# Altium schematic sheet Temperature and Altitude.SchDoc
size A4
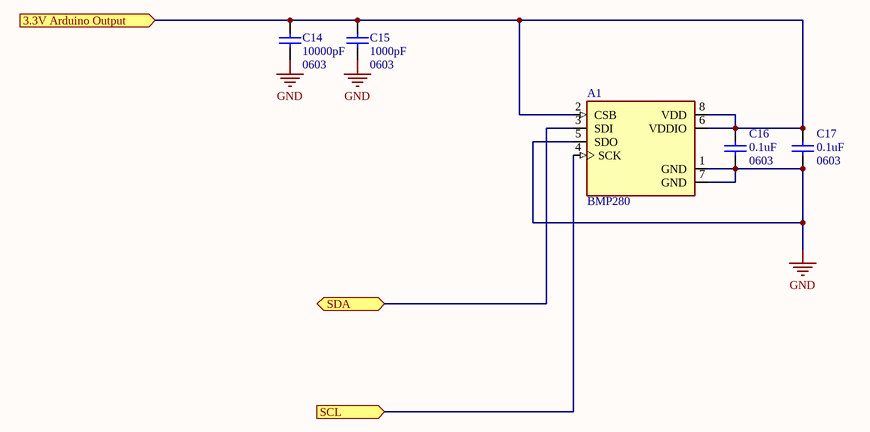
[diagram p0: Temperature and Altitude.SchDoc]

## Parts
A1  BMP280  [8-PIN-METAL-LID-LGA]
C14  10000pF  value 0603  [SMD-0603C]
C15  1000pF  value 0603  [SMD-0603C]
C16  0603  value 0.1uF  [SMD-0603C]
C17  0603  value 0.1uF  [SMD-0603C]

## Ports
3.3V Arduino Output (in), SCL (in), SDA (bidir)

## Nets
GND: A1.1(GND) A1.5(SDO) A1.7(GND) C14.1 C15.1 C16.1 C17.1
3.3V Arduino Output: A1.2(CSB) A1.6(VDDIO) A1.8(VDD) C14.2 C15.2 C16.2 C17.2 ; port 3.3V Arduino Output
SCL: A1.4(SCK) ; port SCL
SDA: A1.3(SDI) ; port SDA

## Library data of the parts
A1 = BMP280: Pressure Sensor 4.35PSI ~ 15.95PSI _30kPa ~ 110kPa_ Absolute 16b 8-SMD; MF: Bosch; SnapEDA_Link: https://www.snapeda.com/parts/BMP280/Bosch%20Sensortec/view-part/1186631/?ref=snap; Package: SMD-8 Bosch Sensortec; MP: BMP280; Value: *; Digi-Key_Part_Number: 828-1064-1-ND; Digi-Key_Purchase_URL: https://www.digikey.com/product-detail/en/bosch-sensortec/BMP280/828-1064-1-ND/6136315?utm_source=snapeda&utm_medium=aggregator&utm_campaign=symbol
C14-C17 = Cap: Capacitor; Published: 8-Jun-2000; LatestRevisionDate: 17-Jul-2002; LatestRevisionNote: Re-released for DXP Platform.; PackageReference: RAD-0.3; Publisher: Altium Limited; PackageDescription: Radial Cap, Thru-Hole; 2 Leads; 0.3 in Pin Spacing